# Altium schematic sheet PressureSensor_Michał.Kapuściński.SchDoc
size A4; SheetNumber: 1; SheetTotal: 1
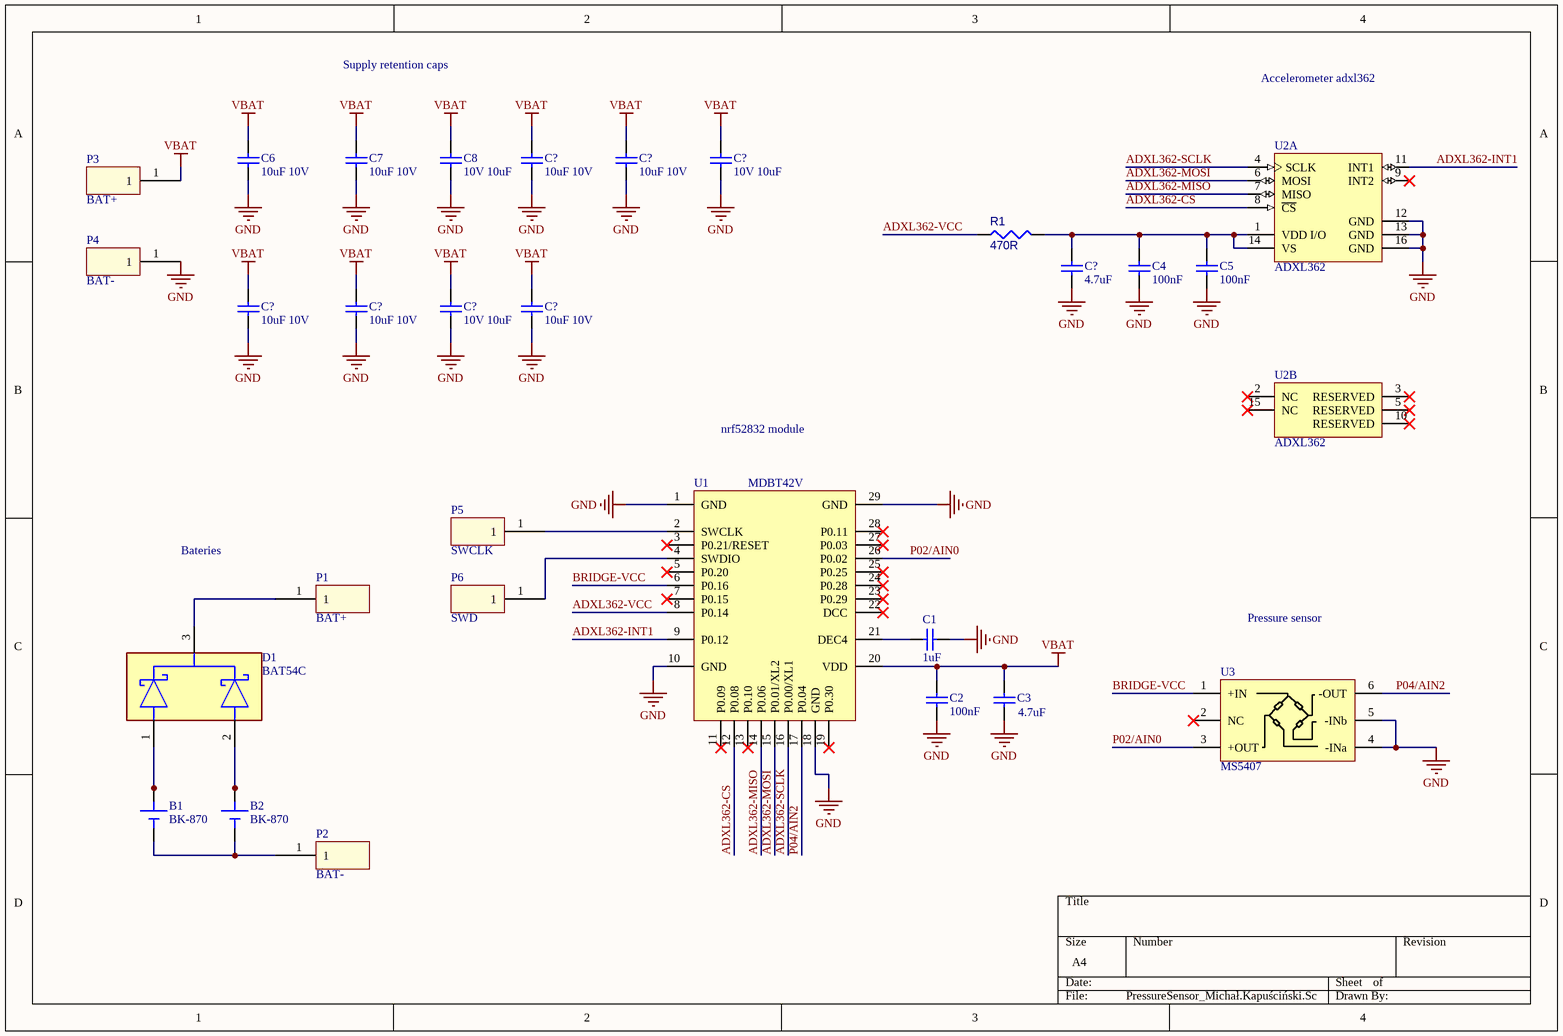
[diagram p0: PressureSensor_Michał.Kapuściński.SchDoc]

## Parts
(Parts that share a designator on the sheet are numbered #1, #2 ... from top to bottom, then left to right.)
B1  BK-870  [BK-870_footprint]
B2  BK-870  [BK-870_footprint]
C1  1uF  [!!!! MOJ capacitor !!!!-Footprint-1]
C2  100nF  [!!!! MOJ capacitor !!!!-Footprint-1]
C3  4.7uF  [New footprint 1]
C4  100nF  [!!!! MOJ capacitor !!!!-Footprint-1]
C5  100nF  [!!!! MOJ capacitor !!!!-Footprint-1]
C6  10uF 10V  [!!! moj cap 0805 IPC_A]
C7  10uF 10V  [!!! moj cap 0805 IPC_A]
C8  10V 10uF  [!!! moj cap 0805 IPC_A]
C?#1  10uF 10V  [!!! moj cap 0805 IPC_A]
C?#2  10uF 10V  [!!! moj cap 0805 IPC_A]
C?#3  10V 10uF  [!!! moj cap 0805 IPC_A]
C?#4  4.7uF  [!!!! MOJ capacitor !!!!-Footprint-1]
C?#5  10uF 10V  [!!! moj cap 0805 IPC_A]
C?#6  10uF 10V  [!!! moj cap 0805 IPC_A]
C?#7  10V 10uF  [!!! moj cap 0805 IPC_A]
C?#8  10uF 10V  [!!! moj cap 0805 IPC_A]
D1  BAT54C  [FP-MA03D-IPC_B]
P1  BAT+  [SMD wire pad-Footprint-1]
P2  BAT-  [SMD wire pad-Footprint-1]
P3  BAT+  [SMD wire pad-Footprint-1]
P4  BAT-  [SMD wire pad-Footprint-1]
P5  SWCLK  [SMD wire pad-Footprint-1]
P6  SWD  [SMD wire pad-Footprint-1]
R1  470R  [!!!! Moj Resistor !!!!-Footprint-2]
U1  MDBT42V  [MDBT42V]
U2  ADXL362  [ADI-CC-16-4_N]  (parts A,B of 2)
U3  MS5407  [MD-PS002-Footprint-1]

## Nets
GND: C1.1 C2.1 C3.1 C4.1 C5.1 C6.1 C7.1 C8.1 C?#1.1 C?#2.1 C?#3.1 C?#4.1 C?#5.1 C?#6.1 C?#7.1 C?#8.1 P4.1 U1.1(GND) U1.10(GND) U1.18(GND) U1.29(GND) U2.12(GND) U2.13(GND) U2.16(GND) U3.4(-INa) U3.5(-INb)
VBAT: C2.2 C3.2 C6.2 C7.2 C8.2 C?#1.2 C?#2.2 C?#3.2 C?#5.2 C?#6.2 C?#7.2 C?#8.2 P3.1 U1.20(VDD)
ADXL362-CS: U1.12(P0.08) U2.8(~{CS})
ADXL362-INT1: U1.9(P0.12) U2.11(INT1)
ADXL362-MISO: U1.14(P0.06) U2.7(MISO)
ADXL362-MOSI: U1.15(P0.01/XL2) U2.6(MOSI)
ADXL362-SCLK: U1.16(P0.00/XL1) U2.4(SCLK)
ADXL362-VCC: R1.1 U1.8(P0.14)
BRIDGE-VCC: U1.6(P0.16) U3.1(+IN)
P02/AIN0: U1.26(P0.02) U3.3(+OUT)
P04/AIN2: U1.17(P0.04) U3.6(-OUT)
NetB1_1: B1.1(P) B1.3(P) D1.1(1_ANODE)
NetB1_2: B1.2(M) B2.2(M) P2.1
NetB2_1: B2.1(P) B2.3(P) D1.2(2_ANODE)
NetC1_2: C1.2 U1.21(DEC4)
NetC4_2: C4.2 C5.2 C?#4.2 R1.2 U2.1(VDD_I/O) U2.14(VS)
NetD1_3: D1.3(COMMON_CATHODE) P1.1
NetP5_1: P5.1 U1.2(SWCLK)
NetP6_1: P6.1 U1.4(SWDIO)

Not connected (* = marked no-connect by the designer): U1 3(P0.21/RESET)* 5(P0.20)* 7(P0.15)* 11(P0.09)* 13(P0.10)* 19(P0.30)* 22(DCC)* 23(P0.29)* 24(P0.28)* 25(P0.25)* 27(P0.03)* 28(P0.11)*; U2 2(NC)* 3(RESERVED)* 5(RESERVED)* 9(INT2)* 10(RESERVED)* 15(NC)*; U3 2(NC)*

## Notes on the sheet
- Supply retention caps
- Accelerometer adxl362
- nrf52832 module
- Bateries
- Pressure sensor

## Library data of the parts
B1 B2 = CMP-018-000000-3: Battery Retainer Coin, 10.0mm 1 Cell SMD _SMT_ Tab; MF: MPD _Memory; Availability: Unavailable; Package: DFN-8 MPD; Source: SnapEDAsch.SchLib; Design Item ID: BK-870; Value: *; Pin Count: 3; Component Type: Standard; MP: BK-870; Price: None; SnapEDA_Link: https://www.snapeda.com/parts/BK-870/MPD%20_Memory%20Protection%20Devices_/view-part/554643/?ref=snap
C1-C8 C?#1-C?#8 = CMP-001-0000-6: 0402 + 0603
D1 = CMP-07162-000010-1: DIODE ARRAY SCHOTTKY 30V SOT23-3; Obsolete Part: true; Manufacturer: ON Semiconductor; Max Junction Temp: +150°C; Forward Current: 200mA; Peak Reverse Current: 2uA; Standoff Height: 0mm; Capacitance: 10pF; Max Surge Forward Current: 600mA; Value: 10pF; Device Class L3: Schottky Diodes; ComponentLink2Description: Datasheet; Category: Diode; Max Repetitive Reverse Voltage: 30V; ComponentLink2URL: https://media.digikey.com/pdf/Data%20Sheets/ON%20Semiconductor%20PDFs/BAT54(A,C,S).pdf; Package: MA03D; Octopart: https://octopart.com/bat54c-on+semiconductor-8095621; Height: 1.2mm; Reverse Voltage: 30V; Manufacturer Part Number: BAT54C; Automotive: No; Device Class L1: Discrete Semiconductors; Temperature Range Low: -55°C; Device Class L2: Diodes; Digikey Description: DIODE ARRAY SCHOTTKY 30V SOT23-3; Temperature: -55°C to +150°C; Temperature Range High: +150°C
P1-P6 = CMP-00000-2: SMD wire pad
R1 = CMP-009-00178-10: 0603 + 0402
U1 = CMP-009-000000-2: Design Item ID: MDBT42V; Source: MDBT42V_SCHLIB_210701.SchLib
U2 = CMP-012-000000-1: Micropower, 3-Axis, +/-2 g / +/-4 g / +/-8 g Digital Output MEMS Accelerometer with 200 Hz BW, Industrial, 16-pin LGA, Reel; Manufacturer: Analog Devices; PartNumber: ADXL362BCCZ-R2; Voltage Supply (V): 1.6 to 3.5; Sensitivity: 1/2/4 mg/LSB; Supply Current: 1.8 uA; -3dB Bandwidth: 200 Hz; # of Axes: 3; PackageVersion: 10-23-2012-A, 10/2012; ComponentLink3Description: Package Specification; ComponentLink2URL: http://www.analog.com/static/imported-files/data_sheets/ADXL362.pdf; ComponentLink4URL: http://www.analog.com/en/mems-sensors/mems-inertial-sensors/adxl362/products/product.html; ComponentLink3URL: http:/www.analog.com/static/imported-files/packages/PKG_PDF/LGA(CC)/CC_16_4.pdf; PackageDescription: 16-Pin Land Grid Array, 3.25 x 3 mm Body, 0.5 mm Pitch; Source: adxl362.SchLib; ComponentLink2Description: Datasheet; Packing: Reel; Design Item ID: CMP-0885-00039-1; ComponentLink1URL: http://www.analog.com/en/index.html; Output Type: Digital; ComponentLink4Description: Product URL; Mounting Technology: Surface Mount; PackageReference: CC-16-4; ComponentLink1Description: Manufacturer URL; DatasheetVersion: Rev. B
U3 = CMP-010-00024-2: Pressure sensor